# Altium project PCB_Project1.PrjPCB
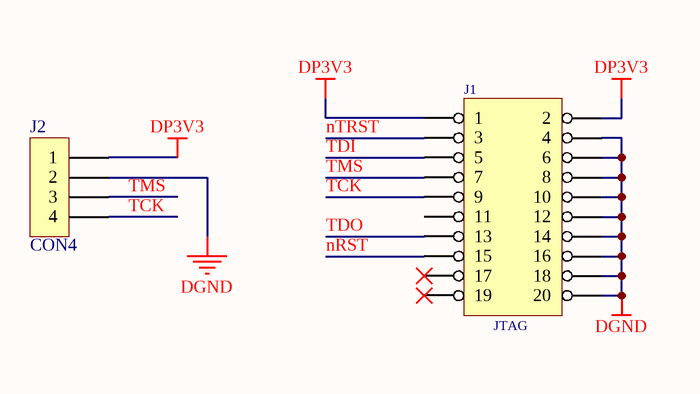
[diagram p0: MT-SWD V1.0.SchDoc]
1 sheet, 2 parts. Net scope: global (net labels, ports and power ports of the same name join across sheets).
Board file: MT-SWD V1.0.0.PcbDoc

## Sheet MT-SWD V1.0.SchDoc
size A4

### Parts
J1  JTAG  [FH12-10S-1SH]
J2  CON4  [COM4-2.54mm-90]

### Nets
DGND: J1.4 J1.6 J1.8 J1.10 J1.12 J1.14 J1.16 J1.18 J1.20 J2.2
DP3V3: J1.1 J1.2 J2.1
nRST: J1.15
nTRST: J1.3
TCK: J1.9 J2.4
TDI: J1.5
TDO: J1.13
TMS: J1.7 J2.3

Not connected (* = marked no-connect by the designer): J1 11 17* 19*

### Library data of the parts
J1 = HEADER 10X2
J2 = CON4: Connector